# Altium schematic sheet MCU.SchDoc: Microcontroller
size A4; SheetNumber: 2; SheetTotal: 10; Project: WSN Z1; Comments: MSP430 16-Bit; PageSetup: Record=PageOptions|CenterHorizontal=True|CenterVertical=True|PrintScale=0.97|XCorrection=1.00|YCorrection=1.00|PrintKind=1|BorderSize=5000000|LeftOffset=0|BottomOffset=0|Orientation=2|PaperLength=2970|PaperWidth=2100|Scale=100|PaperSource=7|PrintQuality=1200|MediaType=1|DitherType=10|PaperKind=A4|PrintScaleMode=1
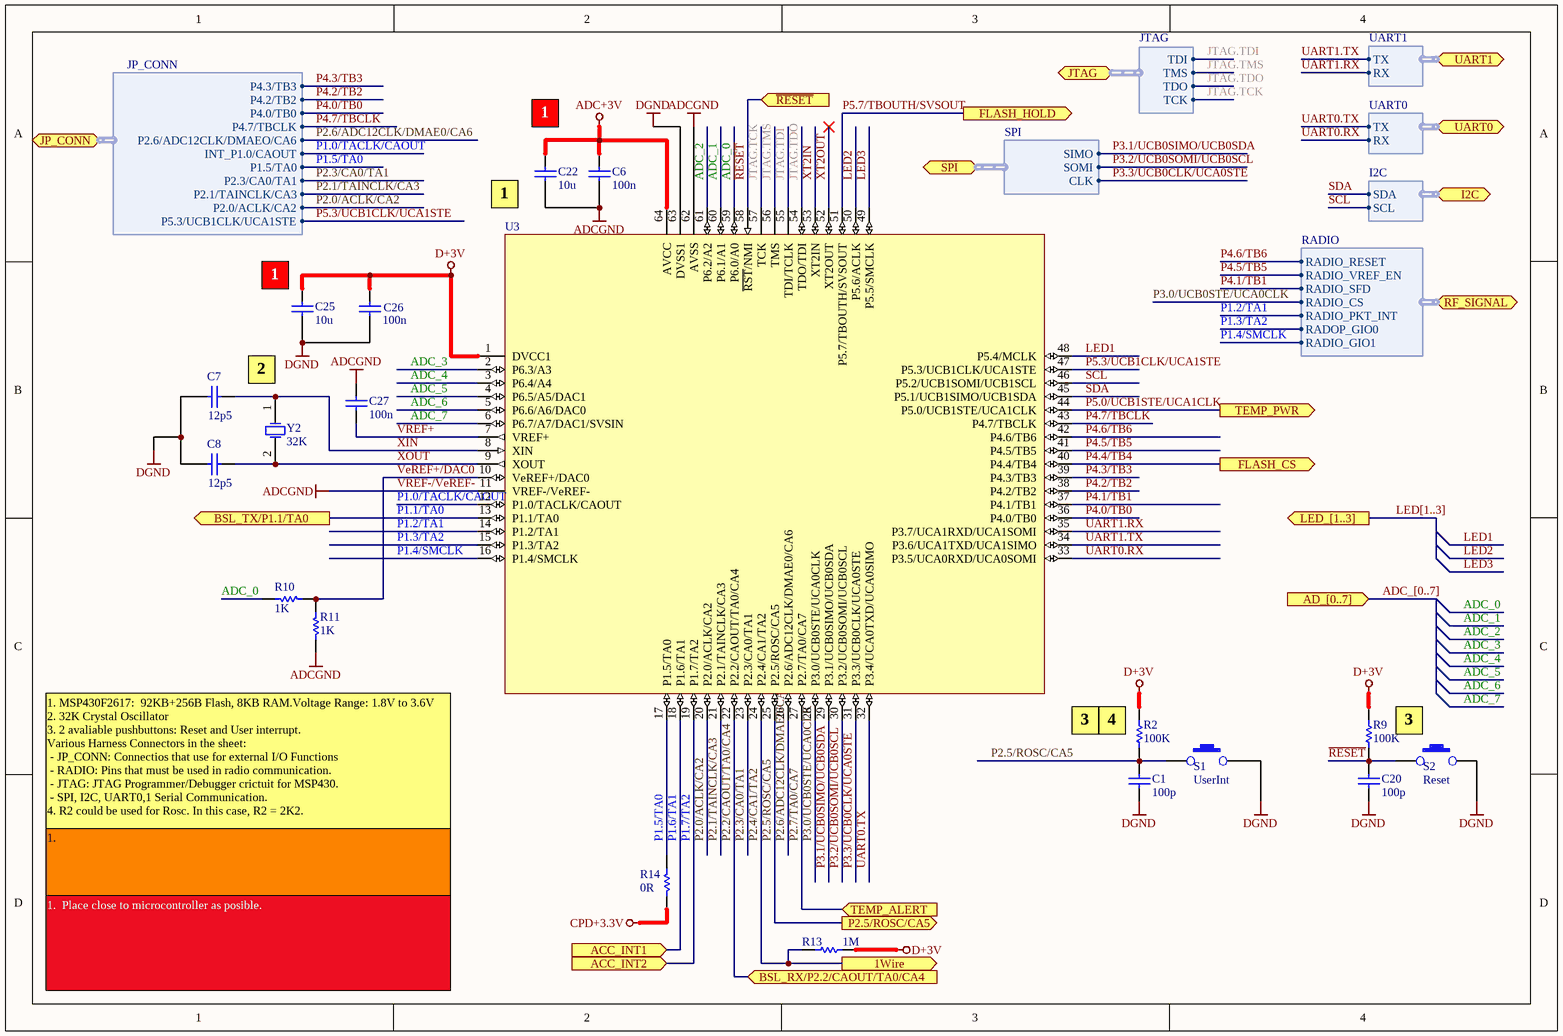
[diagram p0: MCU.SchDoc]

## Parts
C1  value 100p  [CC-0402-AL]  (hidden comment: Cap Semi)
C6  value 100n  [CC-0402-AL]  (hidden comment: Cap Semi)
C7  value 12p5  [CC-0402-AL]  (hidden comment: Cap Semi)
C8  value 12p5  [CC-0402-AL]  (hidden comment: Cap Semi)
C20  value 100p  [CC-0402-AL]  (hidden comment: Cap Semi)
C22  value 10u  [CC1608-0603]  (hidden comment: Cap Semi)
C25  value 10u  [CC1608-0603]  (hidden comment: Cap Semi)
C26  value 100n  [CC-0402-AL]  (hidden comment: Cap Semi)
C27  value 100n  [CC-0402-AL]  (hidden comment: Cap Semi)
R2  value 100K  [CR1005-0402]  (hidden comment: Res Semi)
R9  value 100K  [CR-0402-AL]  (hidden comment: Res Semi)
R10  value 1K  [CR-0402-AL]  (hidden comment: Res Semi)
R11  value 1K  [CR-0402-AL]  (hidden comment: Res Semi)
R13  value 1M  [CR-0402-AL]  (hidden comment: Res Semi)
R14  value 0R  [CR-0402-AL]  (hidden comment: Res Semi)
S1  UserInt  [B3U-1000P]
S2  Reset  [B3U-1000P]
U3  MSP430F2617TPMR  [F-QFP10x10-G64/N]  (value not drawn)
Y2  32K  [ABS07-32.768KHZ-7-T]

## Ports
1Wire (out), ACC_INT1 (in), ACC_INT2 (in), AD_[0..7] (in), BSL_RX/P2.2/CAOUT/TA0/CA4 (in), BSL_TX/P1.1/TA0 (out), FLASH_CS (out), FLASH_HOLD (out), I2C (harness I2C), JP_CONN (harness JP_CONN), JTAG (harness JTAG), LED_[1..3] (out), P2.5/ROSC/CA5 (out), RF_SIGNAL (harness RADIO), SPI (harness SPI), TEMP_ALERT (in), TEMP_PWR (out), UART0 (harness UART0), UART1 (harness UART1), ~{RESET} (in)

## Harnesses
I2C: SCL, SDA
UART0: RX, TX
UART1: RX, TX
JTAG: TCK, TDI, TDO, TMS
SPI: CLK, SOMI, SIMO
RADIO: RADIO_RESET, RADIO_VREF_EN, RADIO_SFD, RADIO_PKT_INT, RADOP_GIO0, RADIO_GIO1, RADIO_CS
JP_CONN: P2.0/ACLK/CA2, P2.1/TAINCLK/CA3, P2.3/CA0/TA1, P1.5/TA0, INT_P1.0/CAOUT, P2.6/ADC12CLK/DMAEO/CA6, P4.7/TBCLK, P4.0/TB0, P4.2/TB2, P4.3/TB3, P5.3/UCB1CLK/UCA1STE

## Nets
ADC+3V: C6.1 C22.1 U3.64(AVCC)
ADCGND: C6.2 C22.2 C27.1 R11.1 U3.11(VREF-/VeREF-) U3.62(AVSS)
CPD+3.3V: R14.1
D+3V: C25.1 C26.1 R2.1 R9.2 R13.1 U3.1(DVCC1)
DGND: C1.2 C7.1 C8.1 C20.2 C25.2 C26.2 S1.2 S2.2 U3.63(DVSS1)
ADC_0: R10.2 U3.59(P6.0/A0)
ADC_1: U3.60(P6.1/A1)
ADC_2: U3.61(P6.2/A2)
ADC_3: U3.2(P6.3/A3)
ADC_4: U3.3(P6.4/A4)
ADC_5: U3.4(P6.5/A5/DAC1)
ADC_6: U3.5(P6.6/A6/DAC0)
ADC_7: U3.6(P6.7/A7/DAC1/SVSIN)
JTAG.TCK: U3.57(TCK) ; port JTAG.TCK
JTAG.TDI: U3.55(TDI/TCLK) ; port JTAG.TDI
JTAG.TDO: U3.54(TDO/TDI) ; port JTAG.TDO
JTAG.TMS: U3.56(TMS) ; port JTAG.TMS
LED1: U3.48(P5.4/MCLK)
LED2: U3.50(P5.6/ACLK)
LED3: U3.49(P5.5/SMCLK)
P1.0/TACLK/CAOUT: U3.12(P1.0/TACLK/CAOUT) ; port JP_CONN.INT_P1.0/CAOUT
P1.1/TA0: U3.13(P1.1/TA0) ; port BSL_TX/P1.1/TA0
P1.2/TA1: U3.14(P1.2/TA1) ; port RF_SIGNAL.RADIO_PKT_INT
P1.3/TA2: U3.15(P1.3/TA2) ; port RF_SIGNAL.RADOP_GIO0
P1.4/SMCLK: U3.16(P1.4/SMCLK) ; port RF_SIGNAL.RADIO_GIO1
P1.5/TA0: R14.2 U3.17(P1.5/TA0) ; port JP_CONN.P1.5/TA0
P1.6/TA1: U3.18(P1.6/TA1) ; port ACC_INT1
P1.7/TA2: U3.19(P1.7/TA2) ; port ACC_INT2
P2.0/ACLK/CA2: U3.20(P2.0/ACLK/CA2) ; port JP_CONN.P2.0/ACLK/CA2
P2.1/TAINCLK/CA3: U3.21(P2.1/TAINCLK/CA3) ; port JP_CONN.P2.1/TAINCLK/CA3
P2.2/CAOUT/TA0/CA4: U3.22(P2.2/CAOUT/TA0/CA4) ; port BSL_RX/P2.2/CAOUT/TA0/CA4
P2.3/CA0/TA1: U3.23(P2.3/CA0/TA1) ; port JP_CONN.P2.3/CA0/TA1
P2.4/CA1/TA2: R13.2 U3.24(P2.4/CA1/TA2) ; port 1Wire
P2.5/ROSC/CA5: C1.1 R2.2 S1.1 U3.25(P2.5/ROSC/CA5) ; port P2.5/ROSC/CA5
P2.6/ADC12CLK/DMAE0/CA6: U3.26(P2.6/ADC12CLK/DMAE0/CA6) ; port JP_CONN.P2.6/ADC12CLK/DMAEO/CA6
P2.7/TA0/CA7: U3.27(P2.7/TA0/CA7) ; port TEMP_ALERT
P3.0/UCB0STE/UCA0CLK: U3.28(P3.0/UCB0STE/UCA0CLK) ; port RF_SIGNAL.RADIO_CS
P3.1/UCB0SIMO/UCB0SDA: U3.29(P3.1/UCB0SIMO/UCB0SDA) ; port SPI.SIMO
P3.2/UCB0SOMI/UCB0SCL: U3.30(P3.2/UCB0SOMI/UCB0SCL) ; port SPI.SOMI
P3.3/UCB0CLK/UCA0STE: U3.31(P3.3/UCB0CLK/UCA0STE) ; port SPI.CLK
P4.0/TB0: U3.36(P4.0/TB0) ; port JP_CONN.P4.0/TB0
P4.1/TB1: U3.37(P4.1/TB1) ; port RF_SIGNAL.RADIO_SFD
P4.2/TB2: U3.38(P4.2/TB2) ; port JP_CONN.P4.2/TB2
P4.3/TB3: U3.39(P4.3/TB3) ; port JP_CONN.P4.3/TB3
P4.4/TB4: U3.40(P4.4/TB4) ; port FLASH_CS
P4.5/TB5: U3.41(P4.5/TB5) ; port RF_SIGNAL.RADIO_VREF_EN
P4.6/TB6: U3.42(P4.6/TB6) ; port RF_SIGNAL.RADIO_RESET
P4.7/TBCLK: U3.43(P4.7/TBCLK) ; port JP_CONN.P4.7/TBCLK
P5.0/UCB1STE/UCA1CLK: U3.44(P5.0/UCB1STE/UCA1CLK) ; port TEMP_PWR
P5.3/UCB1CLK/UCA1STE: U3.47(P5.3/UCB1CLK/UCA1STE) ; port JP_CONN.P5.3/UCB1CLK/UCA1STE
P5.7/TBOUTH/SVSOUT: U3.51(P5.7/TBOUTH/SVSOUT) ; port FLASH_HOLD
~{RESET}: C20.1 R9.1 S2.1 U3.58(~{RST}/NMI) ; port ~{RESET}
SCL: U3.46(P5.2/UCB1SOMI/UCB1SCL) ; port I2C.SCL
SDA: U3.45(P5.1/UCB1SIMO/UCB1SDA) ; port I2C.SDA
UART0.RX: U3.33(P3.5/UCA0RXD/UCA0SOMI) ; port UART0.RX
UART0.TX: U3.32(P3.4/UCA0TXD/UCA0SIMO) ; port UART0.TX
UART1.RX: U3.35(P3.7/UCA1RXD/UCA1SOMI) ; port UART1.RX
UART1.TX: U3.34(P3.6/UCA1TXD/UCA1SIMO) ; port UART1.TX
VeREF+/DAC0: R10.1 R11.2 U3.10(VeREF+/DAC0)
VREF+: C27.2 U3.7(VREF+)
XIN: C7.2 U3.8(XIN) Y2.1(OSC1)
XOUT: C8.2 U3.9(XOUT) Y2.2(OSC2)
XT2IN: U3.53(XT2IN)
XT2OUT: U3.52(XT2OUT)

## Buses and harness runs
bus ADC_[0..7] = port AD_[0..7]
bus LED[1..3] = port LED_[1..3]

## Notes on the sheet
- 1
- (near C25) 1
- 2
- (near U3) VREF-/VeREF-
- 3
- (near R2) 4
- 1. MSP430F2617:  92KB+256B Flash, 8KB RAM.Voltage Range: 1.8V to 3.6V
  2. 32K Crystal Oscillator
  3. 2 avaliable pushbuttons: Reset and User interrupt.
  Various Harness Connectors in the sheet:
  - JP_CONN: Connectios that use for external I/O Functions
  - RADIO: Pins that must be used in radio communication.
  - JTAG: JTAG Programmer/Debugger crictuit for MSP430.
  - SPI, I2C, UART0,1 Serial Communication.
  4. R2 could be used for Rosc. In this case, R2 = 2K2.
- 1.
- 1.  Place close to microcontroller as posible.

## Library data of the parts
C1 C6-C8 C20 C26 C27 = Cap Semi: Capacitor (Semiconductor SIM Model)
C22 C25 = Cap Semi: CAP CER 10UF 6.3V X5R 0603
R2 = Res Semi: Semiconductor Resistor; Manufacturer: Generic Components
R9-R11 R13 R14 = Res Semi: Semiconductor Resistor
S1 S2 = B3U-1000P: Ultra-small Tactile Switch
U3 = MSP430F2617TPMR: MSP430F2617TPMR MICROCONTROLLER
Y2 = XTAL: Crystal Oscillator; Manufacturer: Generic Components; Value: 32Khz